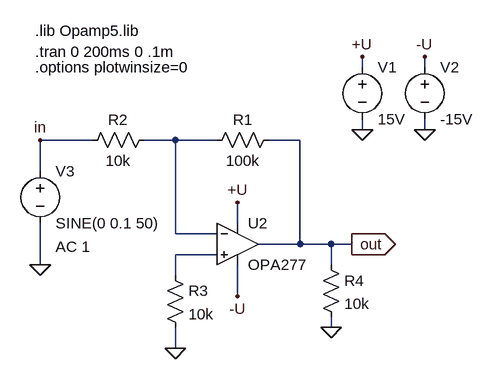
[diagram p0: schematic OPA277test_inv.asc]
OPA277test_inv.asc, the LTspice schematic file:
Version 4
SHEET 1 880 680
WIRE 368 -48 368 -64
WIRE 464 -48 464 -64
WIRE 368 48 368 32
WIRE 464 48 464 32
WIRE -48 64 -128 64
WIRE 80 64 32 64
WIRE 144 64 80 64
WIRE 272 64 224 64
WIRE -128 112 -128 64
WIRE 176 192 176 160
WIRE 80 208 80 64
WIRE 144 208 80 208
WIRE 272 224 272 64
WIRE 272 224 208 224
WIRE 320 224 272 224
WIRE 352 224 320 224
WIRE 144 240 80 240
WIRE -128 256 -128 192
WIRE 320 256 320 224
WIRE 80 272 80 240
WIRE 176 304 176 256
WIRE 320 352 320 336
WIRE 80 384 80 352
FLAG 368 48 0
FLAG 464 48 0
FLAG 368 -64 +U
FLAG 176 160 +U
FLAG 176 304 -U
FLAG 464 -64 -U
FLAG 80 384 0
FLAG -128 256 0
FLAG 320 352 0
FLAG 352 224 out
IOPIN 352 224 Out
FLAG -128 64 in
SYMBOL voltage 368 -64 R0
WINDOW 123 0 0 Left 0
WINDOW 39 0 0 Left 0
SYMATTR InstName V1
SYMATTR Value 15V
SYMBOL res 240 48 R90
WINDOW 0 0 56 VBottom 0
WINDOW 3 32 56 VTop 0
SYMATTR InstName R1
SYMATTR Value 100k
SYMBOL res 48 48 R90
WINDOW 0 0 56 VBottom 0
WINDOW 3 32 56 VTop 0
SYMATTR InstName R2
SYMATTR Value 10k
SYMBOL voltage -128 96 R0
WINDOW 123 24 132 Left 0
WINDOW 39 0 0 Left 0
SYMATTR Value2 AC 1
SYMATTR InstName V3
SYMATTR Value SINE(0 0.1 50)
SYMBOL res 64 256 R0
SYMATTR InstName R3
SYMATTR Value 10k
SYMBOL res 304 240 R0
SYMATTR InstName R4
SYMATTR Value 10k
SYMBOL Opamps\\opamp2 176 160 R0
SYMATTR InstName U2
SYMATTR Value OPA277
SYMBOL voltage 464 -64 R0
WINDOW 123 0 0 Left 0
WINDOW 39 0 0 Left 0
SYMATTR InstName V2
SYMATTR Value -15V
TEXT -136 -104 Left 0 !.lib Opamp5.lib
TEXT -136 -72 Left 0 !.tran 0 200ms 0 .1m
TEXT -136 -48 Left 0 !.options plotwinsize=0

The netlist it stands for:
* OPA277test_inv.asc
V1 +U 0 15V
R1 out N001 100k
R2 N001 in 10k
V3 in 0 SINE(0 0.1 50) AC 1
R3 N002 0 10k
R4 out 0 10k
XU2 N002 N001 +U -U out OPA277  ; pins In+ In- V+ V- OUT
V2 -U 0 -15V
.lib Opamp5.lib
.tran 0 200ms 0 .1m
.options plotwinsize=0
.backanno
.end